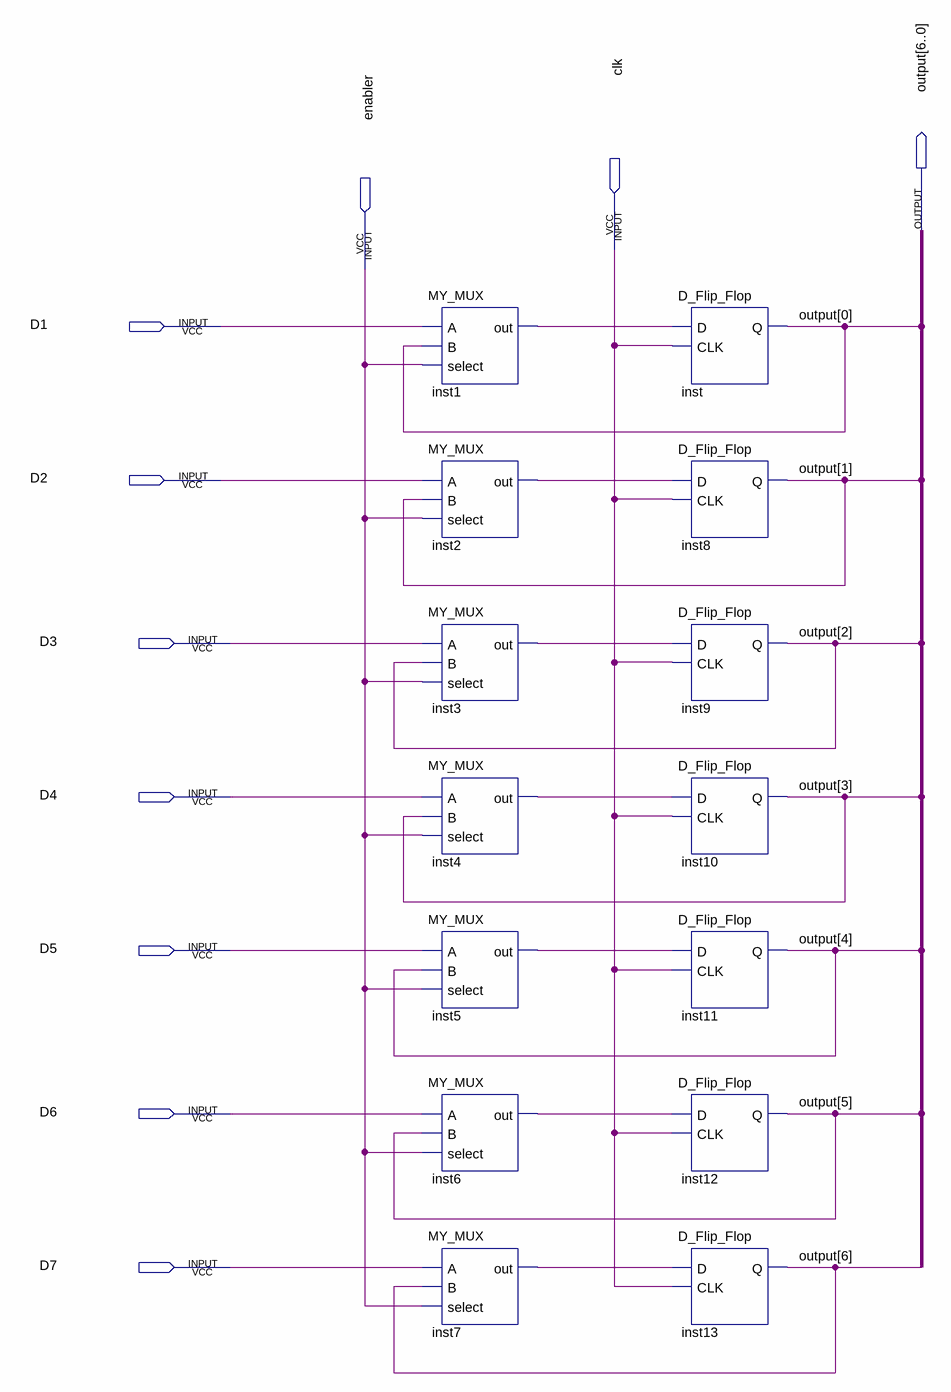
[diagram p0: schematic sheet]
// Quartus schematic memorySeventBits.bdf as structural Verilog: 14 symbols, 10 pins
module memorySeventBits (
  input  clk,
  input  enabler,
  input  D1,
  input  D2,
  input  D3,
  input  D4,
  input  D5,
  input  D6,
  input  D7,
  output [6:0] \output 
);

  wire inst1_out, inst2_out, inst3_out, inst4_out, inst5_out, inst6_out, inst7_out;

  MY_MUX inst1 (.A(D1), .B(\output [0]), .select(enabler), .out(inst1_out));
  MY_MUX inst2 (.A(D2), .B(\output [1]), .select(enabler), .out(inst2_out));
  MY_MUX inst3 (.A(D3), .B(\output [2]), .select(enabler), .out(inst3_out));
  MY_MUX inst4 (.A(D4), .B(\output [3]), .select(enabler), .out(inst4_out));
  MY_MUX inst5 (.A(D5), .B(\output [4]), .select(enabler), .out(inst5_out));
  MY_MUX inst6 (.A(D6), .B(\output [5]), .select(enabler), .out(inst6_out));
  MY_MUX inst7 (.A(D7), .B(\output [6]), .select(enabler), .out(inst7_out));
  D_Flip_Flop inst (.D(inst1_out), .CLK(clk), .Q(\output [0]));
  D_Flip_Flop inst8 (.D(inst2_out), .CLK(clk), .Q(\output [1]));
  D_Flip_Flop inst9 (.D(inst3_out), .CLK(clk), .Q(\output [2]));
  D_Flip_Flop inst10 (.D(inst4_out), .CLK(clk), .Q(\output [3]));
  D_Flip_Flop inst11 (.D(inst5_out), .CLK(clk), .Q(\output [4]));
  D_Flip_Flop inst12 (.D(inst6_out), .CLK(clk), .Q(\output [5]));
  D_Flip_Flop inst13 (.D(inst7_out), .CLK(clk), .Q(\output [6]));
endmodule
